# EAGLE design board (EAGLE 7.7.0)
REVISION: use makecam
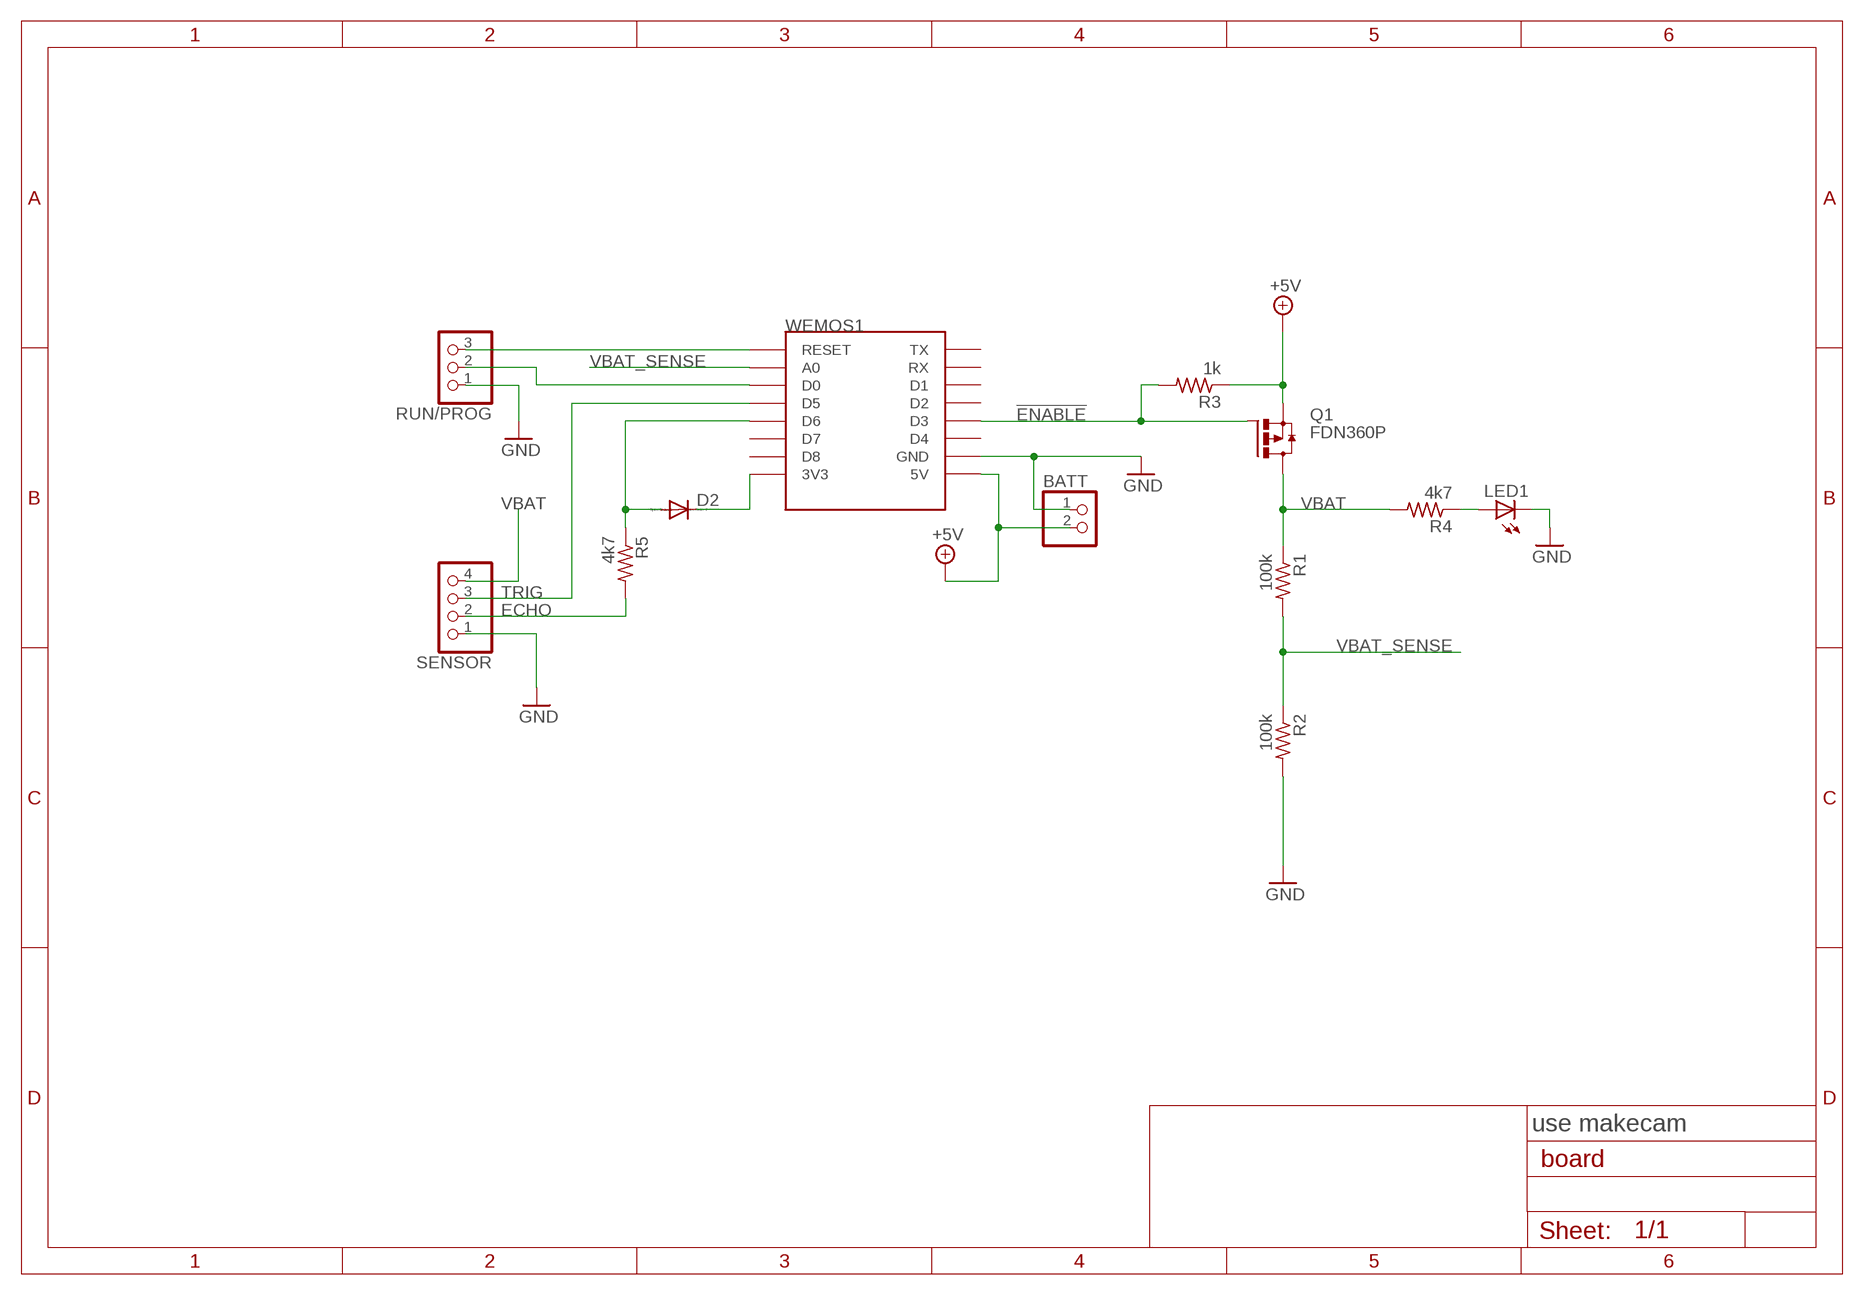
[diagram p0: schematic, sheet 1]

## Parts
BATT  PINHD-1X2  [1X02]
D2  DIODE-SOD323-W  [SOD323-W]
LED1  LEDSML1206  [SML1206]
Q1  FDN360P  [SUPER-SOT3]
R1  100k  R-US_R0805  [R0805]
R2  100k  R-US_R0805  [R0805]
R3  1k  R-US_R0805  [R0805]
R4  4k7  R-US_R0805  [R0805]
R5  4k7  R-US_R0805  [R0805]
REV1  REVISION  [REVISION]
RUN/PROG  PINHD-1X3/90  [1X03/90]
SENSOR  PINHD-1X4/90  [1X04/90]
WEMOS1  WEMOS-D1-MINI  [WEMOS-D1-MINI]

## Nets
!ENABLE: Q1.1(G) R3.2 WEMOS1.D3
+5V: BATT.2 Q1.2(S) R3.1 WEMOS1.5V
ECHO: R5.2 SENSOR.2
GND: BATT.1 LED1.C R2.2 RUN/PROG.1 SENSOR.1 WEMOS1.GND
N$1: RUN/PROG.3 WEMOS1.RESET
N$2: RUN/PROG.2 WEMOS1.D0
N$3: D2.C WEMOS1.3V3
N$6: LED1.A R4.1
N$8: D2.A R5.1 WEMOS1.D6
TRIG: SENSOR.3 WEMOS1.D5
VBAT: Q1.3(D) R1.1 R4.2 SENSOR.4
VBAT_SENSE: R1.2 R2.1 WEMOS1.A0
Unconnected: WEMOS1.D1 WEMOS1.D2 WEMOS1.D4 WEMOS1.D7 WEMOS1.D8 WEMOS1.RX WEMOS1.TX

## Library data of the parts
BATT = pinhead:PINHD-1X2: PIN HEADER
D2 = diode:DIODE-: DIODE
LED1 = led:LED: LED OSRAM: - CHIPLED LG R971, LG N971, LY N971, LG Q971, LY Q971, LO R971, LY R971 LH N974, LH R974 LS Q976, LO Q976, LY Q976 LO Q996 - Hyper CHIPLED LW Q18S LB Q993, LB Q99A, LB R99A - SideLED LS A670, LO A670, LY A670, LG A670, LP A670 LB A673, LV A673, LT A673, LW A673 LH A674 LY A675 LS A676, LA A676, LO A676, LY A676, LW A676 LS A679, LY A679, LG A679 - Hyper Micro SIDELED® LS Y876, LA Y876, LO Y876, LY Y876 LT Y87S - SmartLED LW L88C, LW L88S LB L89C, LB L89S, LG L890 LS L89K, LO L89K, LY L89K LS L896, LA L896, LO L896, LY L896 - TOPLED LS T670, LO T670, LY T670, LG T670, LP T670 LSG T670, LSP T670, LSY T670, LOP T670, LYG T670 LG T671, LOG T671, LSG T671 LB T673, LV T673, LT T673, LW T673 LH T674 LS T676, LA T676, LO T676, LY T676, LB T676, LH T676, LSB T676, LW T676 LB T67C, LV T67C, LT T67C, LS T67K, LO T67K, LY T67K, LW E67C LS E67B, LA E67B, LO E67B, LY E67B, LB E67C, LV E67C, LT E67C LW T67C LS T679, LY T679, LG T679 LS T770, LO T770, LY T770, LG T770, LP T770 LB T773, LV T773, LT T773, LW T773 LH T774 LS E675, LA E675, LY E675, LS T675 LS T776, LA T776, LO T776, LY T776, LB T776 LHGB T686 LT T68C, LB T68C - Hyper Mini TOPLED® LB M676 - Mini TOPLED Santana® LG M470 LS M47K, LO M47K, LY M47K Source: http://www.osram.convergy.de LUXEON: - LUMILED® LXK2-PW12-R00, LXK2-PW12-S00, LXK2-PW14-U00, LXK2-PW14-V00 LXK2-PM12-R00, LXK2-PM12-S00, LXK2-PM14-U00 LXK2-PE12-Q00, LXK2-PE12-R00, LXK2-PE12-S00, LXK2-PE14-T00, LXK2-PE14-U00 LXK2-PB12-K00, LXK2-PB12-L00, LXK2-PB12-M00, LXK2-PB14-N00, LXK2-PB14-P00, LXK2-PB14-Q00 LXK2-PR12-L00, LXK2-PR12-M00, LXK2-PR14-Q00, LXK2-PR14-R00 LXK2-PD12-Q00, LXK2-PD12-R00, LXK2-PD12-S00 LXK2-PH12-R00, LXK2-PH12-S00 LXK2-PL12-P00, LXK2-PL12-Q00, LXK2-PL12-R00 Source: www.luxeon.com KINGBRIGHT: KA-3528ASYC Source: www.kingbright.com
Q1 = transistor-power:FDN360P: Single P-Channel, PowerTrench (R) MOSFET Source: http://www.fairchildsemi.com/ds/FD/FDN360P.pdf
R1-R5 = resistor:R-US_: RESISTOR, American symbol
REV1 = build_light:REVISION
RUN/PROG = pinhead:PINHD-1X3: PIN HEADER
SENSOR = pinhead:PINHD-1X4: PIN HEADER
WEMOS1 = esp8266modules:WEMOS-D1-MINI: WeMos.cc D1 mini ESP8266 module

## Board
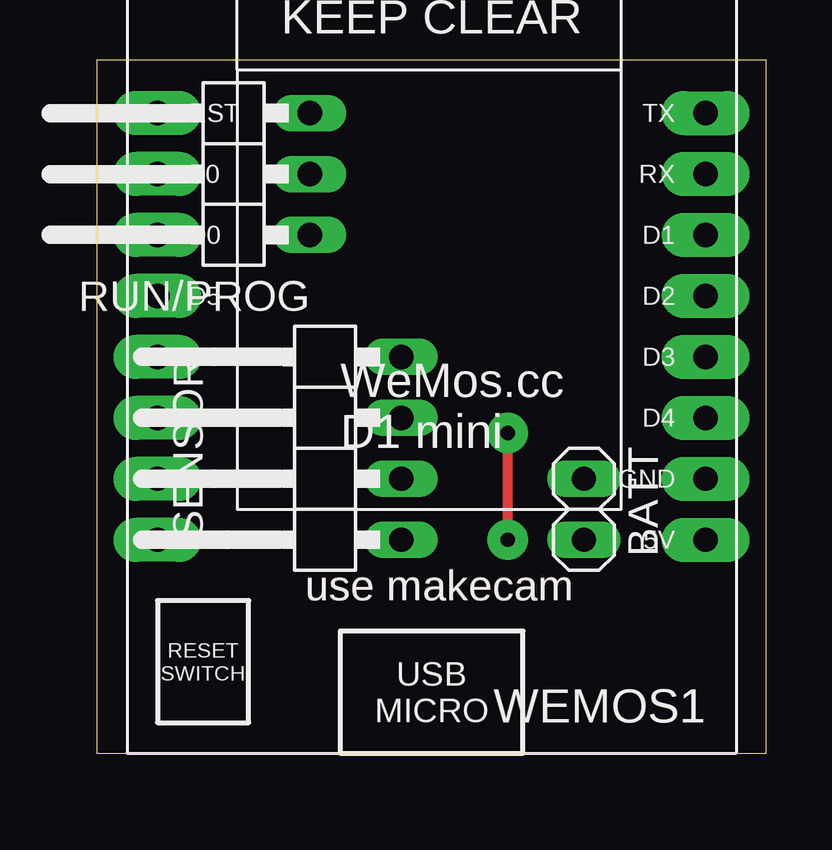
[diagram p1: board, top side]
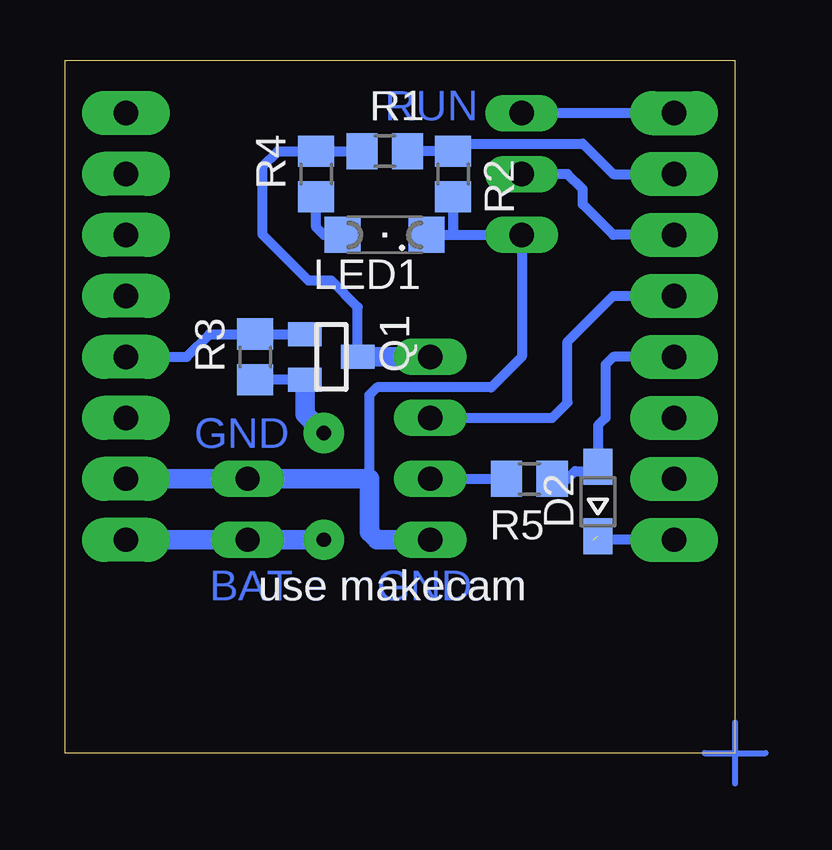
[diagram p2: board, bottom side, seen from below]

Size 27.92 x 28.88 mm. Coordinates in mm from the lower left corner, seen from the top.
Outline: 0,0 27.92,0 27.92,28.88 0,28.88 0,0
Copper layers (1*16): Top 0.035mm / dielectric 1.5mm / Bottom 0.035mm
Design rules "default": minimum track width 10mil, minimum drill 24mil, track to track 8mil, track to pad 8mil, pad to pad 8mil, via to via 8mil, smd to smd 8mil, copper to edge 40mil, drill to drill 8mil, minimum pad ring 10mil, minimum via ring 8mil, stop-mask expansion 4mil, vias tented up to drill 0mil, thermal gap 10mil

### Footprints (pad centres in the part's own frame; a part is rotated, then mirrored left to right if it is on the bottom)
1X02 = drill 1.016 long: 1 -1.27,0; 2 1.27,0
SOD323-W = smd 1.5 x 1.2: A 1.45,0; C -1.45,0
SML1206 = smd 1.5 x 1.5: A 1.75,0; C -1.75,0
SUPER-SOT3 = smd 1 x 1.4: 1 -0.95,-1.1; 2 0.95,-1.1; 3 0,1.1
R0805 = smd 1.3 x 1.5: 1 -0.95,0; 2 0.95,0
1X03/90 = drill 1.016 long: 1 -2.54,-3.81; 2 0,-3.81; 3 2.54,-3.81
1X04/90 = drill 1.016 long: 1 -3.81,-3.81; 2 -1.27,-3.81; 3 1.27,-3.81; 4 3.81,-3.81
WEMOS-D1-MINI = drill 1.016 pad 1.829 long: 3V3 -10.16,-10.16; 5V 12.7,-10.16; A0 -10.16,5.08; D0 -10.16,2.54; D1 12.7,2.54; D2 12.7,0; D3 12.7,-2.54; D4 12.7,-5.08; D5 -10.16,0; D6 -10.16,-2.54; D7 -10.16,-5.08; D8 -10.16,-7.62; GND 12.7,-7.62; RESET -10.16,7.62; RX 12.7,5.08; TX 12.7,7.62

### Placement (x,y rotation side)
BATT  20.32,10.16 270 top
D2  5.71,10.48 90 bottom
LED1  14.61,21.59 180 bottom
Q1  16.83,16.51 270 bottom
R1  14.61,25.08 0 bottom
R2  11.75,24.13 270 bottom
R3  20,16.51 90 bottom
R4  17.46,24.13 90 bottom
R5  8.57,11.43 180 bottom
REV1  14.29,6.99 180 top
RUN/PROG  5.08,24.13 90 top
SENSOR  8.89,12.7 90 top
WEMOS1  12.7,19.05 0 top

### Tracks (layer width: path | path; a pad name or v marks a point on that pad's centre or on a via)
!ENABLE
  Bottom 0.406: WEMOS1.D3 22.86,16.51 21.91,17.46 R3.2 Q1.1
+5V  (via drill 0.6 pad 1.68)
  Top 0.406: v17.14,8.89 v17.14,13.34
  Bottom 0.406: Q1.2 R3.1
  Bottom 0.813: WEMOS1.5V BATT.2 v17.14,8.89 | v17.14,13.34 17.93,14.12 Q1.2
ECHO
  Bottom 0.406: SENSOR.2 R5.2
GND
  Bottom 0.406: 15.24,11.43 15.24,14.92 14.92,15.24 10.16,15.24 8.89,16.51 RUN/PROG.1 11.43,21.59 11.75,21.59 | LED1.C 11.75,21.59 | R2.2 11.75,21.59
  Bottom 0.813: SENSOR.1 14.92,8.89 15.24,9.21 15.24,11.43 BATT.1 WEMOS1.GND
N$1
  Bottom 0.406: WEMOS1.RESET RUN/PROG.3
N$2
  Bottom 0.406: WEMOS1.D0 5.08,21.59 6.35,22.86 6.35,23.5 6.99,24.13 RUN/PROG.2
N$3  (1 unrouted)
  Bottom 0.406: WEMOS1.3V3 5.89,8.89 6.03,9.03
N$4
  Bottom 0.254: 0,1.27 0,-1.27
N$5
  Bottom 0.254: 1.27,0 -1.27,0
N$6
  Bottom 0.406: LED1.A 17.14,21.59 17.46,21.91 R4.1
N$8
  Bottom 0.406: WEMOS1.D6 5.08,16.51 5.4,16.19 5.4,13.97 5.71,13.65 D2.A 5.89,11.75 6.67,11.75 6.99,11.43 R5.1
TRIG
  Bottom 0.406: SENSOR.3 7.62,13.97 6.99,14.61 6.99,17.14 5.08,19.05 WEMOS1.D5
VBAT
  Bottom 0.406: R1.1 R4.2 19.05,25.08 19.68,24.45 19.68,21.59 17.78,19.68 16.83,19.68 15.73,18.59 Q1.3
  Bottom 0.813: Q1.3 SENSOR.4
VBAT_SENSE
  Bottom 0.406: WEMOS1.A0 5.08,24.13 6.35,25.4 11.43,25.4 R2.1 R1.2

### Text on the board
Bottom: RUN | GND | GND | BAT